# EAGLE schematic Sensor_Board (EAGLE 9.6.2)
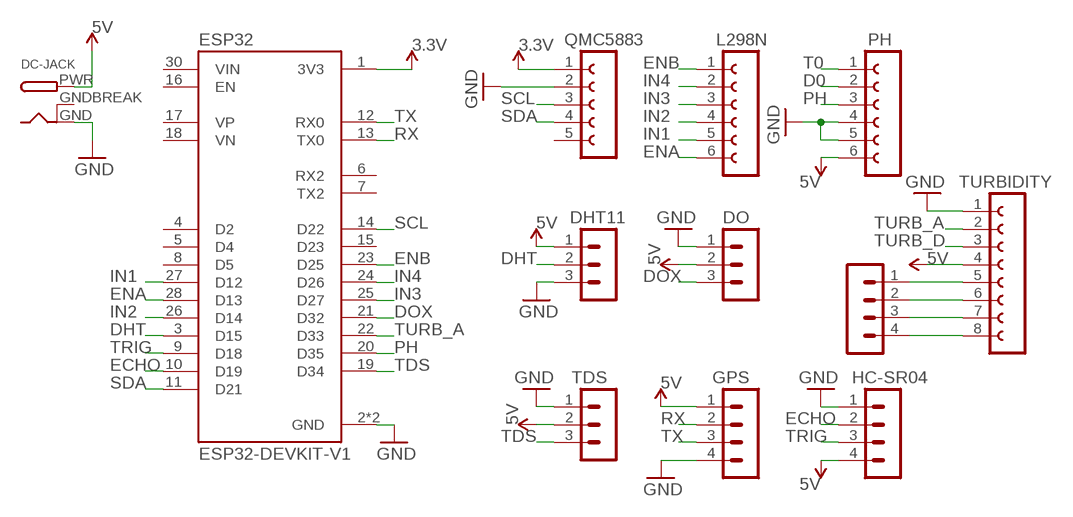
[diagram p0: schematic, sheet 1]

## Parts
DC-JACK  DCBARRELPTH  [DCJACK_2MM_PTH]
DHT11  MA03-1  [MA03-1]
DO  MA03-1  [MA03-1]
ESP32  ESP32-DEVKIT-V1  [MODULE_ESP32_DEVKIT_V1]
GPS  MA04-1  [MA04-1]
HC-SR04  MA04-1  [MA04-1]
L298N  FE06-1  [FE06]
PH  FE06-1  [FE06]
QMC5883  FE05W  [FE05W]
SV10  MA04-1  [MA04-1]
TDS  MA03-1  [MA03-1]
TURBIDITY  FE08-1  [FE08]

## Nets
D0: PH.2
DHT: DHT11.2 ESP32.3(D15)
DOX: DO.3 ESP32.21(D32)
ECHO: ESP32.10(D19) HC-SR04.2
ENA: ESP32.28(D13) L298N.6
ENB: ESP32.23(D25) L298N.1
GND: DC-JACK.GND DHT11.3 DO.1 ESP32.2(GND) ESP32.29(GND) GPS.4 HC-SR04.1 PH.4 PH.5 QMC5883.2 TDS.1 TURBIDITY.1
IN1: ESP32.27(D12) L298N.5
IN2: ESP32.26(D14) L298N.4
IN3: ESP32.25(D27) L298N.3
IN4: ESP32.24(D26) L298N.2
N$3: SV10.1 TURBIDITY.5
N$4: SV10.2 TURBIDITY.6
N$5: SV10.3 TURBIDITY.7
N$6: SV10.4 TURBIDITY.8
PH: ESP32.20(D35) PH.3
RX: ESP32.13(TX0) GPS.2
SCL: ESP32.14(D22) QMC5883.3
SDA: ESP32.11(D21) QMC5883.4
T0: PH.1
TDS: ESP32.19(D34) TDS.3
TRIG: ESP32.9(D18) HC-SR04.3
TURB_A: ESP32.22(D33) TURBIDITY.2
TURB_D: TURBIDITY.3
TX: ESP32.12(RX0) GPS.3
VCC_1: DC-JACK.PWR DHT11.1 DO.2 GPS.1 HC-SR04.4 PH.6 TDS.2 TURBIDITY.4
VCC_2: ESP32.1(3V3) QMC5883.1
Unconnected: ESP32.4(D2) ESP32.5(D4) ESP32.6(RX2) ESP32.7(TX2) ESP32.8(D5) ESP32.15(D23) ESP32.16(EN) ESP32.17(VP) ESP32.18(VN) ESP32.30(VIN) QMC5883.5

## Power pins joined to a net without a drawn wire
GNDBREAK: DC-JACK.GNDBREAK

## Library data of the parts
DC-JACK = adafruit:DCBARREL: 2.0mm DC Barrel Jack DCJACK_2MM_PTH - Through Hole Jack (4UConnector: 05537)
DHT11 DO TDS = con-lstb:MA03-1: PIN HEADER; OC_FARNELL: unknown; OC_NEWARK: unknown
ESP32 = ESP32-DEVKIT-V1:ESP32-DEVKIT-V1: Dual core, Wi-Fi: 2.4 GHz up to 150 Mbits/s,BLE (Bluetooth Low Energy) and legacy Bluetooth, 32 bits, Up to 240 MHz Check availability <https://pricing.snapeda.com/parts/ESP32-DEVKIT-V1/Do%20it/view-part?ref=eda>; AVAILABILITY: Not in stock; DESCRIPTION: Dual core, Wi-Fi: 2.4 GHz up to 150 Mbits/s,BLE (Bluetooth Low Energy) and legacy Bluetooth, 32 bits, Up to 240 MHz; MF: Do it; MP: ESP32-DEVKIT-V1; PACKAGE: None; PRICE: None
GPS HC-SR04 SV10 = con-lstb:MA04-1: PIN HEADER; OC_FARNELL: unknown; OC_NEWARK: unknown
L298N PH = con-lsta:FE06-1: FEMALE HEADER; OC_FARNELL: unknown; OC_NEWARK: unknown
QMC5883 = con-lsta:FE05W: FEMALE HEADER; OC_FARNELL: unknown; OC_NEWARK: unknown
TURBIDITY = con-lsta:FE08-1: FEMALE HEADER; OC_FARNELL: unknown; OC_NEWARK: unknown